# EAGLE design rgb2scart (EAGLE 9.4.0)
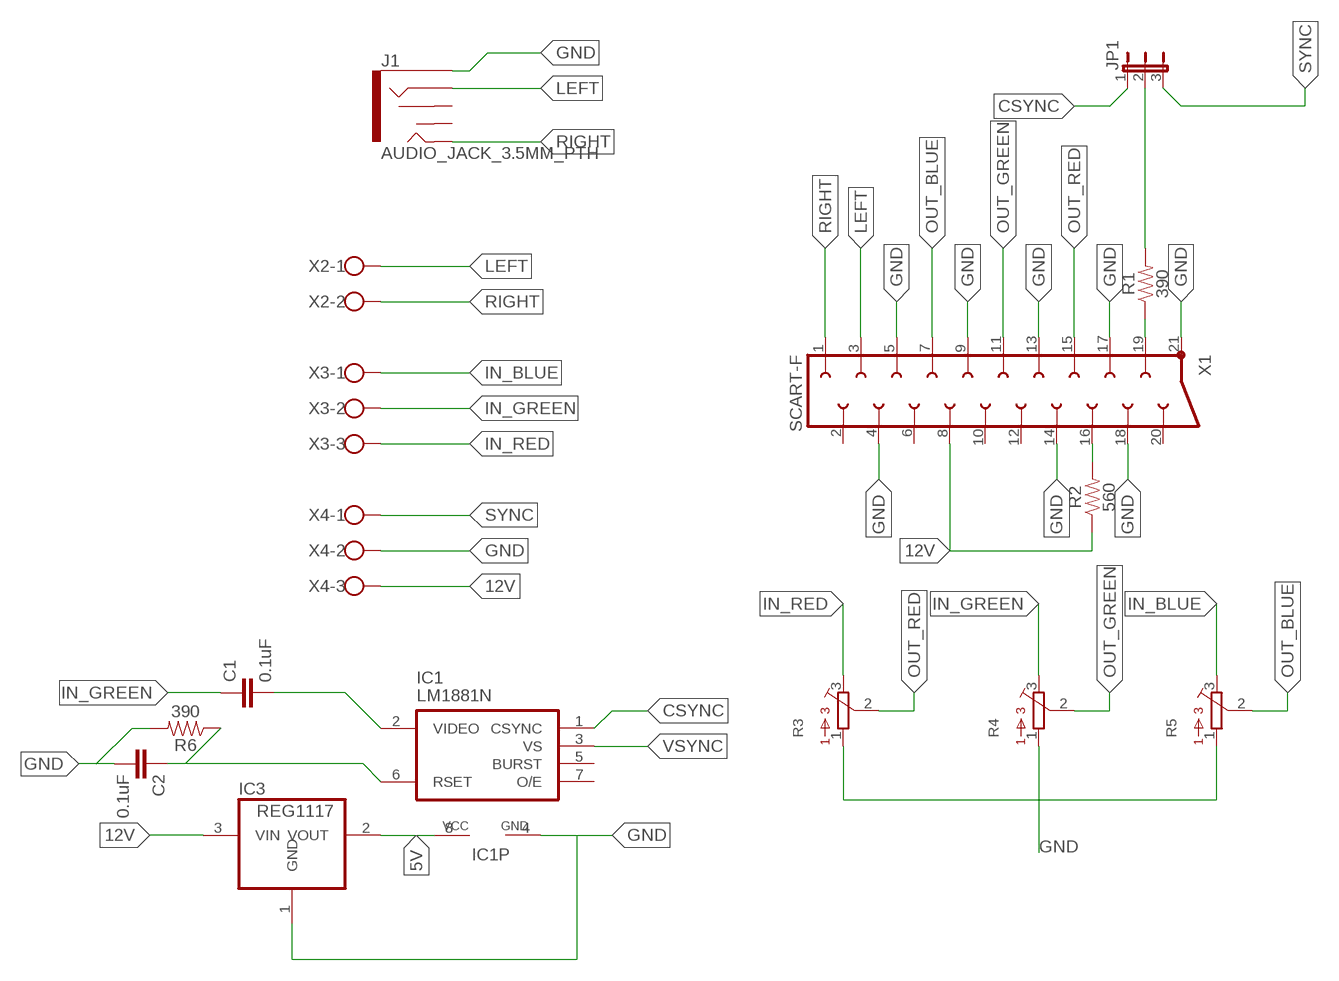
[diagram p0: schematic, sheet 1]

## Parts
C1  0.1uF  0.1UF-KIT-EZ-50V-20%  [CAP-PTH-SMALL-KIT]
C2  0.1uF  0.1UF-KIT-EZ-50V-20%  [CAP-PTH-SMALL-KIT]
IC1  LM1881N  [DIL08]
IC3  REG1117  [SOT223]
J1  AUDIO_JACK_3.5MM_PTH  [AUDIO-JACK]
JP1  JP2E  [JP2]
R1  390  1KOHM-HORIZ-1/4W-1%  [AXIAL-0.3]
R2  560  1KOHM-HORIZ-1/4W-1%  [AXIAL-0.3]
R3  3362P  [3362P]
R4  3362P  [3362P]
R5  3362P  [3362P]
R6  390  1KOHM-HORIZ-1/4W-1%  [AXIAL-0.3]
X1  SCART-F  [SCART-F]
X2  W237-102  [W237-102]
X3  W237-103  [W237-103]
X4  W237-103  [W237-103]

## Nets
5V: IC1.8(VCC) IC3.2(VOUT)
12V [VCC]: IC3.3(VIN) R2.P$1 X1.8 X4.3
CSYNC: IC1.1(CSYNC) JP1.1
GND [GND]: C2.2 IC1.4(GND) IC3.1(GND) J1.SLEEVE R3.1 R4.1 R5.1 R6.P$2 X1.4 X1.5 X1.9 X1.13 X1.14 X1.17 X1.18 X1.21 X4.2
IN_BLUE: R5.3 X3.1
IN_GREEN: C1.1 R4.3 X3.2
IN_RED: R3.3 X3.3
LEFT: J1.RING X1.3 X2.1
N$1: JP1.2 R1.P$2
N$4: C2.1 IC1.6(RSET) R6.P$1
N$5: C1.2 IC1.2(VIDEO)
N$8: R2.P$2 X1.16
N$12: R1.P$1 X1.19
OUT_BLUE: R5.2 X1.7
OUT_GREEN: R4.2 X1.11
OUT_RED: R3.2 X1.15
RIGHT: J1.TIP X1.1 X2.2
SYNC: JP1.3 X4.1
VSYNC: IC1.3(VS)
Unconnected: IC1.5(BURST) IC1.7(O/E) J1.RSH J1.TSH X1.2 X1.6 X1.10 X1.12 X1.20

## Library data of the parts
C1 C2 = SparkFun-Capacitors:0.1UF: 0.1µF ceramic capacitors A capacitor is a passive two-terminal electrical component used to store electrical energy temporarily in an electric field.; PROD_ID: CAP-08370
IC1 = oldchips2:LM1881: Video sync separator
IC3 = burr-brown-5:REG1117: 800mA and 1A Low Dropout (LDO) Positive Regulator 1.8V, 2.5V, 2.85V, 3.3V, 5V, and Adj
J1 = SparkFun-Connectors:AUDIO_JACK_3.5MM: Audio Jack 3.5mm variants of PTH and SMT stereo audio jack with bypass switches. SparkFun Products: SparkFun SparkPunk Sound Kit <[https://www.sparkfun.com/products/11177]> - PTH MP3 Trigger <https://www.sparkfun.com/products/13720> -3.5mm SMD SparkFun PicoBoard <https://www.sparkfun.com/products/11888>- 2.5mm SMD; PROD_ID: CONN-08774; SF_ID: PRT-08032
JP1 = jumper:JP2E: JUMPER
R1 R2 R6 = SparkFun-Resistors:1KOHM: 1kΩ resistor A resistor is a passive two-terminal electrical component that implements electrical resistance as a circuit element. Resistors act to reduce current flow, and, at the same time, act to lower voltage levels within circuits. - Wikipedia; PROD_ID: RES-12182; VALUE: 1k
R3-R5 = bourns:3362: 3362 Series 1/4" Square Trimmer
X1 = con-hirschmann:SCART-F: TV SCART CONNECTOR; OC_FARNELL: unknown; OC_NEWARK: unknown
X2 = con-wago-500:W237-102: WAGO SCREW CLAMP; MPN: 237-102; OC_FARNELL: unknown; OC_NEWARK: 70K9898
X3 X4 = con-wago-500:W237-103: WAGO SCREW CLAMP; MPN: 237-103; OC_FARNELL: unknown; OC_NEWARK: 18M7116

## Net classes
0 default: width 0.152 mm
1 GND: width 0.305 mm
2 VCC: width 0.61 mm

## Board
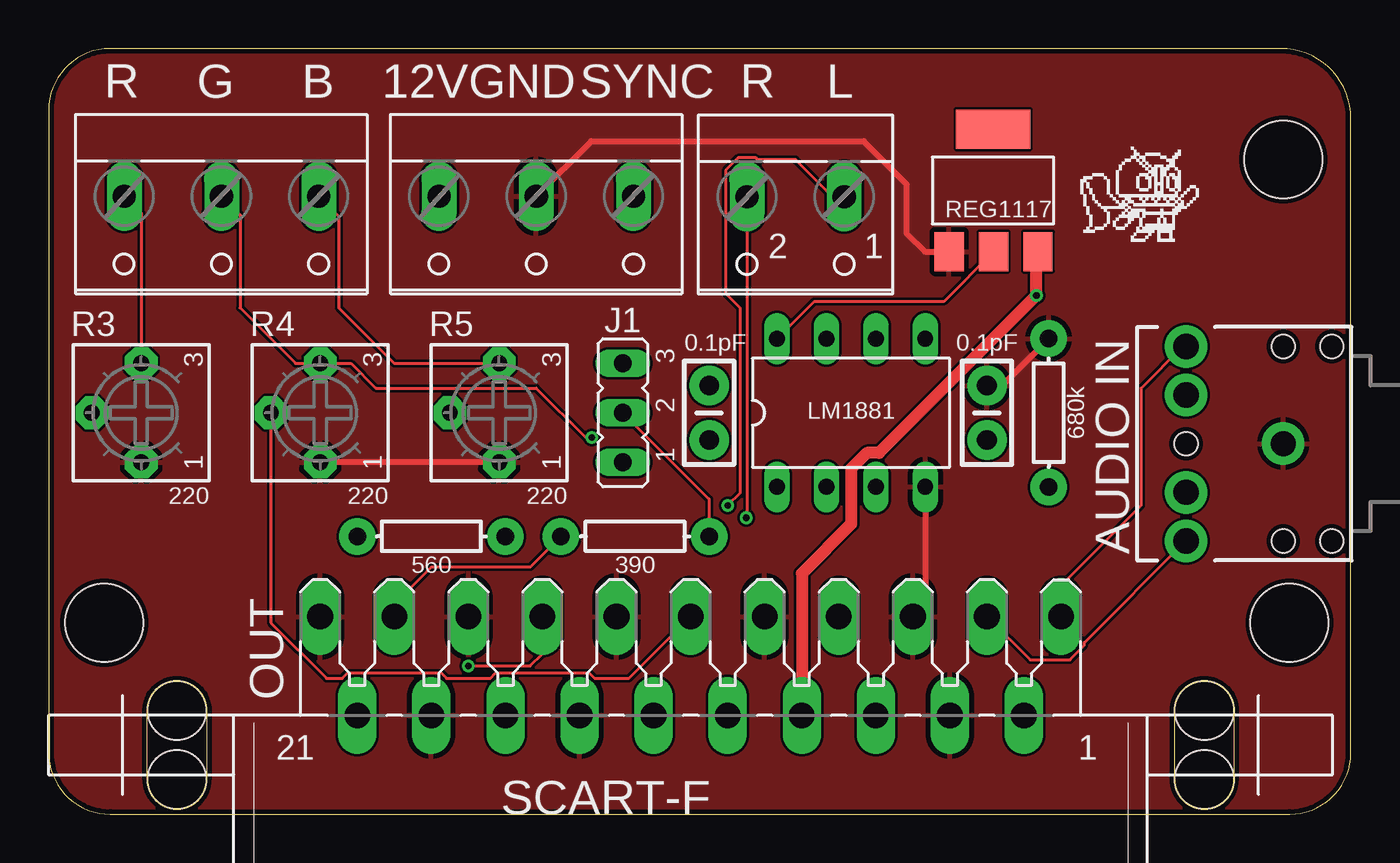
[diagram p1: board, top side]
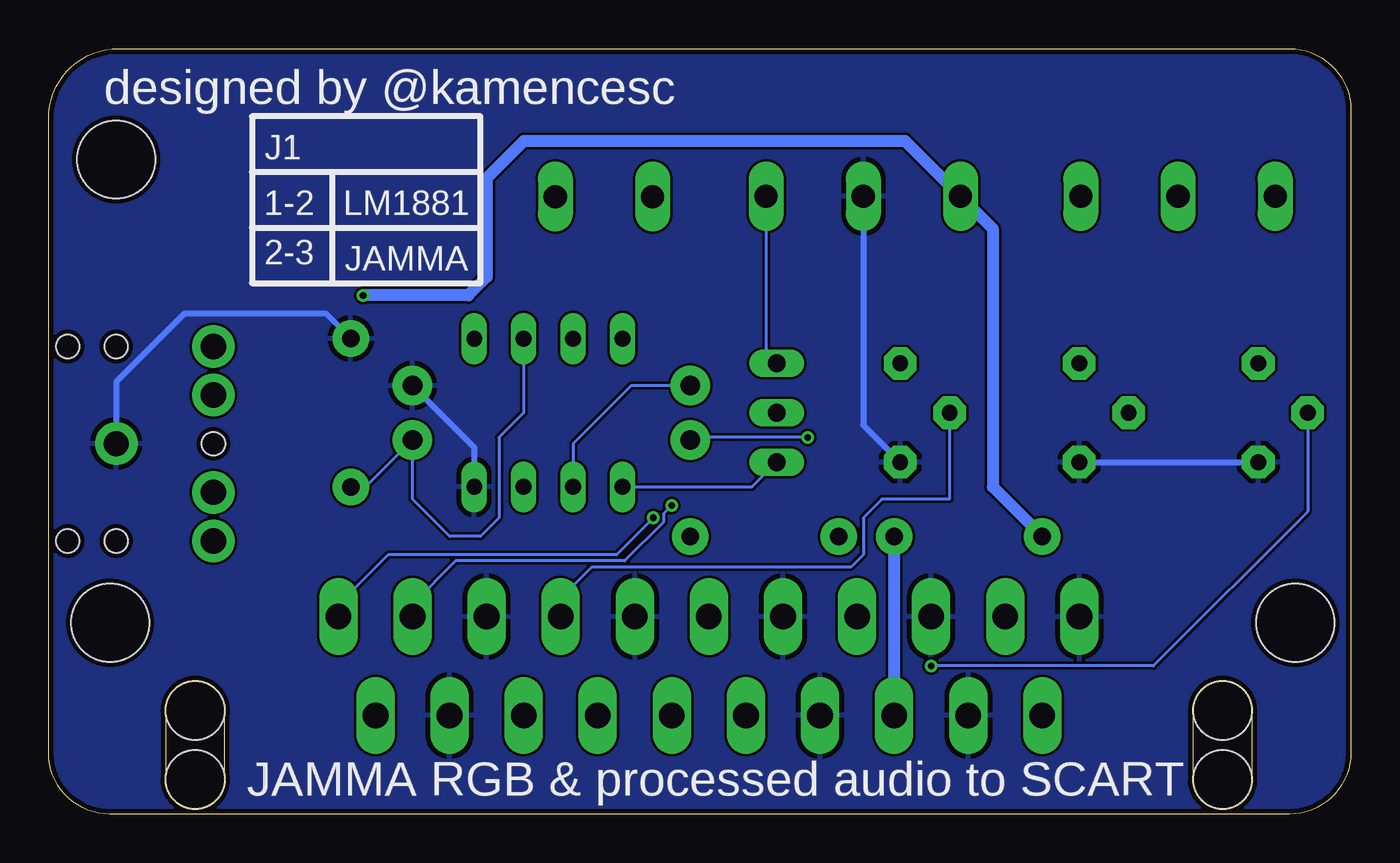
[diagram p2: board, bottom side, seen from below]

Size 66.98 x 39.36 mm. Coordinates in mm from the lower left corner, seen from the top.
Outline: 0,36.2 0,3.17 arc90 3.17,0 63.83,0 arc90 66.98,3.15 66.98,35.76 arc90 63.38,39.36 3.16,39.36 arc90 0,36.2
Copper layers (1*16): Top 0.035mm / dielectric 1.5mm / Bottom 0.035mm
Design rules "dirtypcbs_2_layer": minimum track width 5mil, minimum drill 12mil, track to track 5mil, track to pad 5mil, pad to pad 5mil, via to via 5mil, smd to smd 0mil, copper to edge 10mil, drill to drill 10mil, minimum pad ring 10mil, minimum via ring 6mil, stop-mask expansion 2mil, vias tented up to drill 25mil, thermal gap 10mil
Holes 4 mm at 2.86,9.84 63.82,9.84 63.5,33.66

### Footprints (pad centres in the part's own frame; a part is rotated, then mirrored left to right if it is on the bottom)
CAP-PTH-SMALL-KIT = drill 1.016 pad 2.032: 1 -1.397,0; 2 1.397,0
DIL08 = drill 0.813 long: 1 -3.81,-3.81; 2 -1.27,-3.81; 3 1.27,-3.81; 4 3.81,-3.81; 5 3.81,3.81; 6 1.27,3.81; 7 -1.27,3.81; 8 -3.81,3.81
SOT223 = smd 1.499 x 2.007: 1 -2.261,-3.15; 2 0.025,-3.15; 3 2.311,-3.15 | smd 3.81 x 2.007: 4 0,3.15
AUDIO-JACK = drill 1.3 pad 2.184: RING 5,5; RSH 5,2.5; SLEEVE 0,0; TIP 5,-5; TSH 5,-2.5 | hole 1.2: 0,5; -2.5,5; -2.5,-5; 0,-5; 5,0
JP2 = drill 0.914 long: 1 -2.54,0; 2 0,0; 3 2.54,0
AXIAL-0.3 = drill 0.9 pad 1.88: P$1 -3.81,0; P$2 3.81,0
3362P = drill 0.813 pad 1.676 octagon: 1 -2.54,0; 2 0,2.54; 3 2.54,0
SCART-F = drill 1.321 long: 1 19.05,5.08; 2 17.145,0; 3 15.24,5.08; 4 13.335,0; 5 11.43,5.08; 6 9.525,0; 7 7.62,5.08; 8 5.715,0; 9 3.81,5.08; 10 1.905,0; 11 0,5.08; 12 -1.905,0; 13 -3.81,5.08; 14 -5.715,0; 15 -7.62,5.08; 16 -9.525,0; 17 -11.43,5.08; 18 -13.335,0; 19 -15.24,5.08; 20 -17.145,0; 21 -19.05,5.08 | hole 3.023: 26.416,0.254; 26.416,-3.302; -26.416,0.254; -26.416,-3.302
W237-102 = drill 1.194 long: 1 -2.5,-1.27; 2 2.5,-1.27
W237-103 = drill 1.194 long: 1 -5,-1.29; 2 0,-1.29; 3 5,-1.29

### Placement (x,y rotation side)
C1  33.97,20.64 90 top
C2  48.26,20.64 90 top
IC1  41.27,20.64 0 top
IC3  48.58,32.07 0 top
J1  63.5,19.05 180 top
JP1  29.53,20.64 90 top
R1  30.16,14.29 0 top
R2  19.68,14.29 0 top
R3  4.76,20.64 90 top
R4  13.97,20.64 90 top
R5  23.18,20.64 90 top
R6  51.44,20.64 90 top
X1  33.02,5.08 0 top
X2  38.42,30.48 180 top
X3  8.89,30.48 180 top
X4  25.08,30.48 180 top

### Tracks (layer width: path | path; a pad name or v marks a point on that pad's centre or on a via)
5V
  Top 0.152: IC3.2 46.04,26.35 39.37,26.35 IC1.8
12V  (via drill 0.35)
  Top 0.61: IC3.3 50.8,28.83 v50.8,26.67 42.71,18.58 42.09,18.58 41.27,17.76 41.27,14.92 38.73,12.38 X1.8
  Bottom 0.61: R2.P$1 18.41,16.83 18.41,30.1 X4.3 22.92,34.61 42.55,34.61 44.45,32.7 44.45,27.62 45.4,26.67 v50.8,26.67
CSYNC
  Bottom 0.152: IC1.1 30.8,16.83 JP1.1
GND
  Top 0.305: R5.1 R4.1 | R6.P$2 49.02,22.04 C2.2 | IC1.4 45.09,10.79 X1.5 | X4.2 27.92,34.61 41.91,34.61 44.13,32.38 44.13,29.84 45.06,28.92 IC3.1
  Bottom 0.305: X4.2 25.08,20 R5.1 | R4.1 R3.1 | R6.P$2 52.7,25.72 60.01,25.72 63.5,22.23 J1.SLEEVE | C2.2 45.09,18.86 IC1.4
  pour Top: -1.91,40.96 67.63,40.96 67.63,-2.22 -1.91,-2.22
  pour Bottom: -2.54,40.64 68.26,40.64 68.26,-1.59 -2.54,-1.59
IN_BLUE
  Top 0.152: X3.1 14.92,30.74 14.92,26.04 17.78,23.18 R5.3
IN_GREEN  (via drill 0.35)
  Top 0.152: X3.2 9.84,30.82 9.84,26.04 12.7,23.18 R4.3 15.56,23.18 16.83,21.91 25.08,21.91 27.62,19.37 v27.94,19.37
  Bottom 0.152: v27.94,19.37 33.85,19.37 C1.1
IN_RED
  Top 0.152: X3.3 4.76,30.9 R3.3
LEFT  (via drill 0.35)
  Top 0.152: X2.1 40.32,31.75 38.42,33.66 36.46,33.66 36.37,33.74 35.46,33.74 34.82,33.1 34.82,26.78 35.56,26.04 35.56,16.51 v34.92,15.88 | X1.3 50.48,7.94 52.53,7.94 53.26,8.68 53.26,8.81 J1.RING
  Bottom 0.152: v34.92,15.88 35.35,15.45 35.35,15.02 37.35,13.02 46.04,13.02 48.26,10.79 X1.3
N$1
  Top 0.152: JP1.2 33.97,16.19 R1.P$2
N$4
  Bottom 0.152: IC1.6 42.55,20.64 43.81,19.37 43.81,15.24 44.77,14.29 46.35,14.29 48.26,16.19 C2.1 50.67,16.83 R6.P$1
N$5
  Bottom 0.152: C1.2 37.02,22.04 40.01,19.05 IC1.2
N$8
  Bottom 0.61: R2.P$2 X1.16
N$12
  Top 0.152: R1.P$1 24.77,12.7 19.68,12.7 17.78,10.79 X1.19
OUT_BLUE
  Bottom 0.152: R5.2 20.64,16.19 24.13,16.19 25.08,15.24 25.08,13.34 25.72,12.7 39.05,12.7 40.64,11.11 X1.7
OUT_GREEN
  Top 0.152: R4.2 11.43,9.84 14.29,6.99 15.1,6.99 15.38,7.26 20.18,7.26 20.46,6.99 22.72,6.99 23,7.26 27.8,7.26 28.08,6.99 29.84,6.99 X1.11
OUT_RED  (via drill 0.35)
  Top 0.152: v21.59,7.62 24.77,7.62 25.4,8.26 X1.15
  Bottom 0.152: R3.2 2.22,15.56 10.16,7.62 v21.59,7.62
RIGHT  (via drill 0.35)
  Top 0.152: X2.2 35.92,15.28 v35.88,15.24 | X1.1 52.07,11.75 56.2,15.88 56.2,21.91 58.34,24.05 J1.TIP
  Bottom 0.152: v35.88,15.24 37.78,13.34 49.53,13.34 52.07,10.79 X1.1
SYNC
  Bottom 0.152: X4.1 30.08,23.73 JP1.3

### Text on the board
tPlace: OUT
tNames: R | G | B | 12V | GND | SYNC | R | L | J1 | 0.1pF | 0.1pF | AUDIO IN | 680k | LM1881 | 220 | 220 | 220
bNames: designed by @kamencesc | J1 | LM1881 | 1-2 | 2-3 | JAMMA | JAMMA RGB & processed audio to SCART